# Altium schematic sheet USB_PLEIADES.SchDoc
size Tabloid; Sheet_Name: Insert name in Document Parameters; Size: 11x17
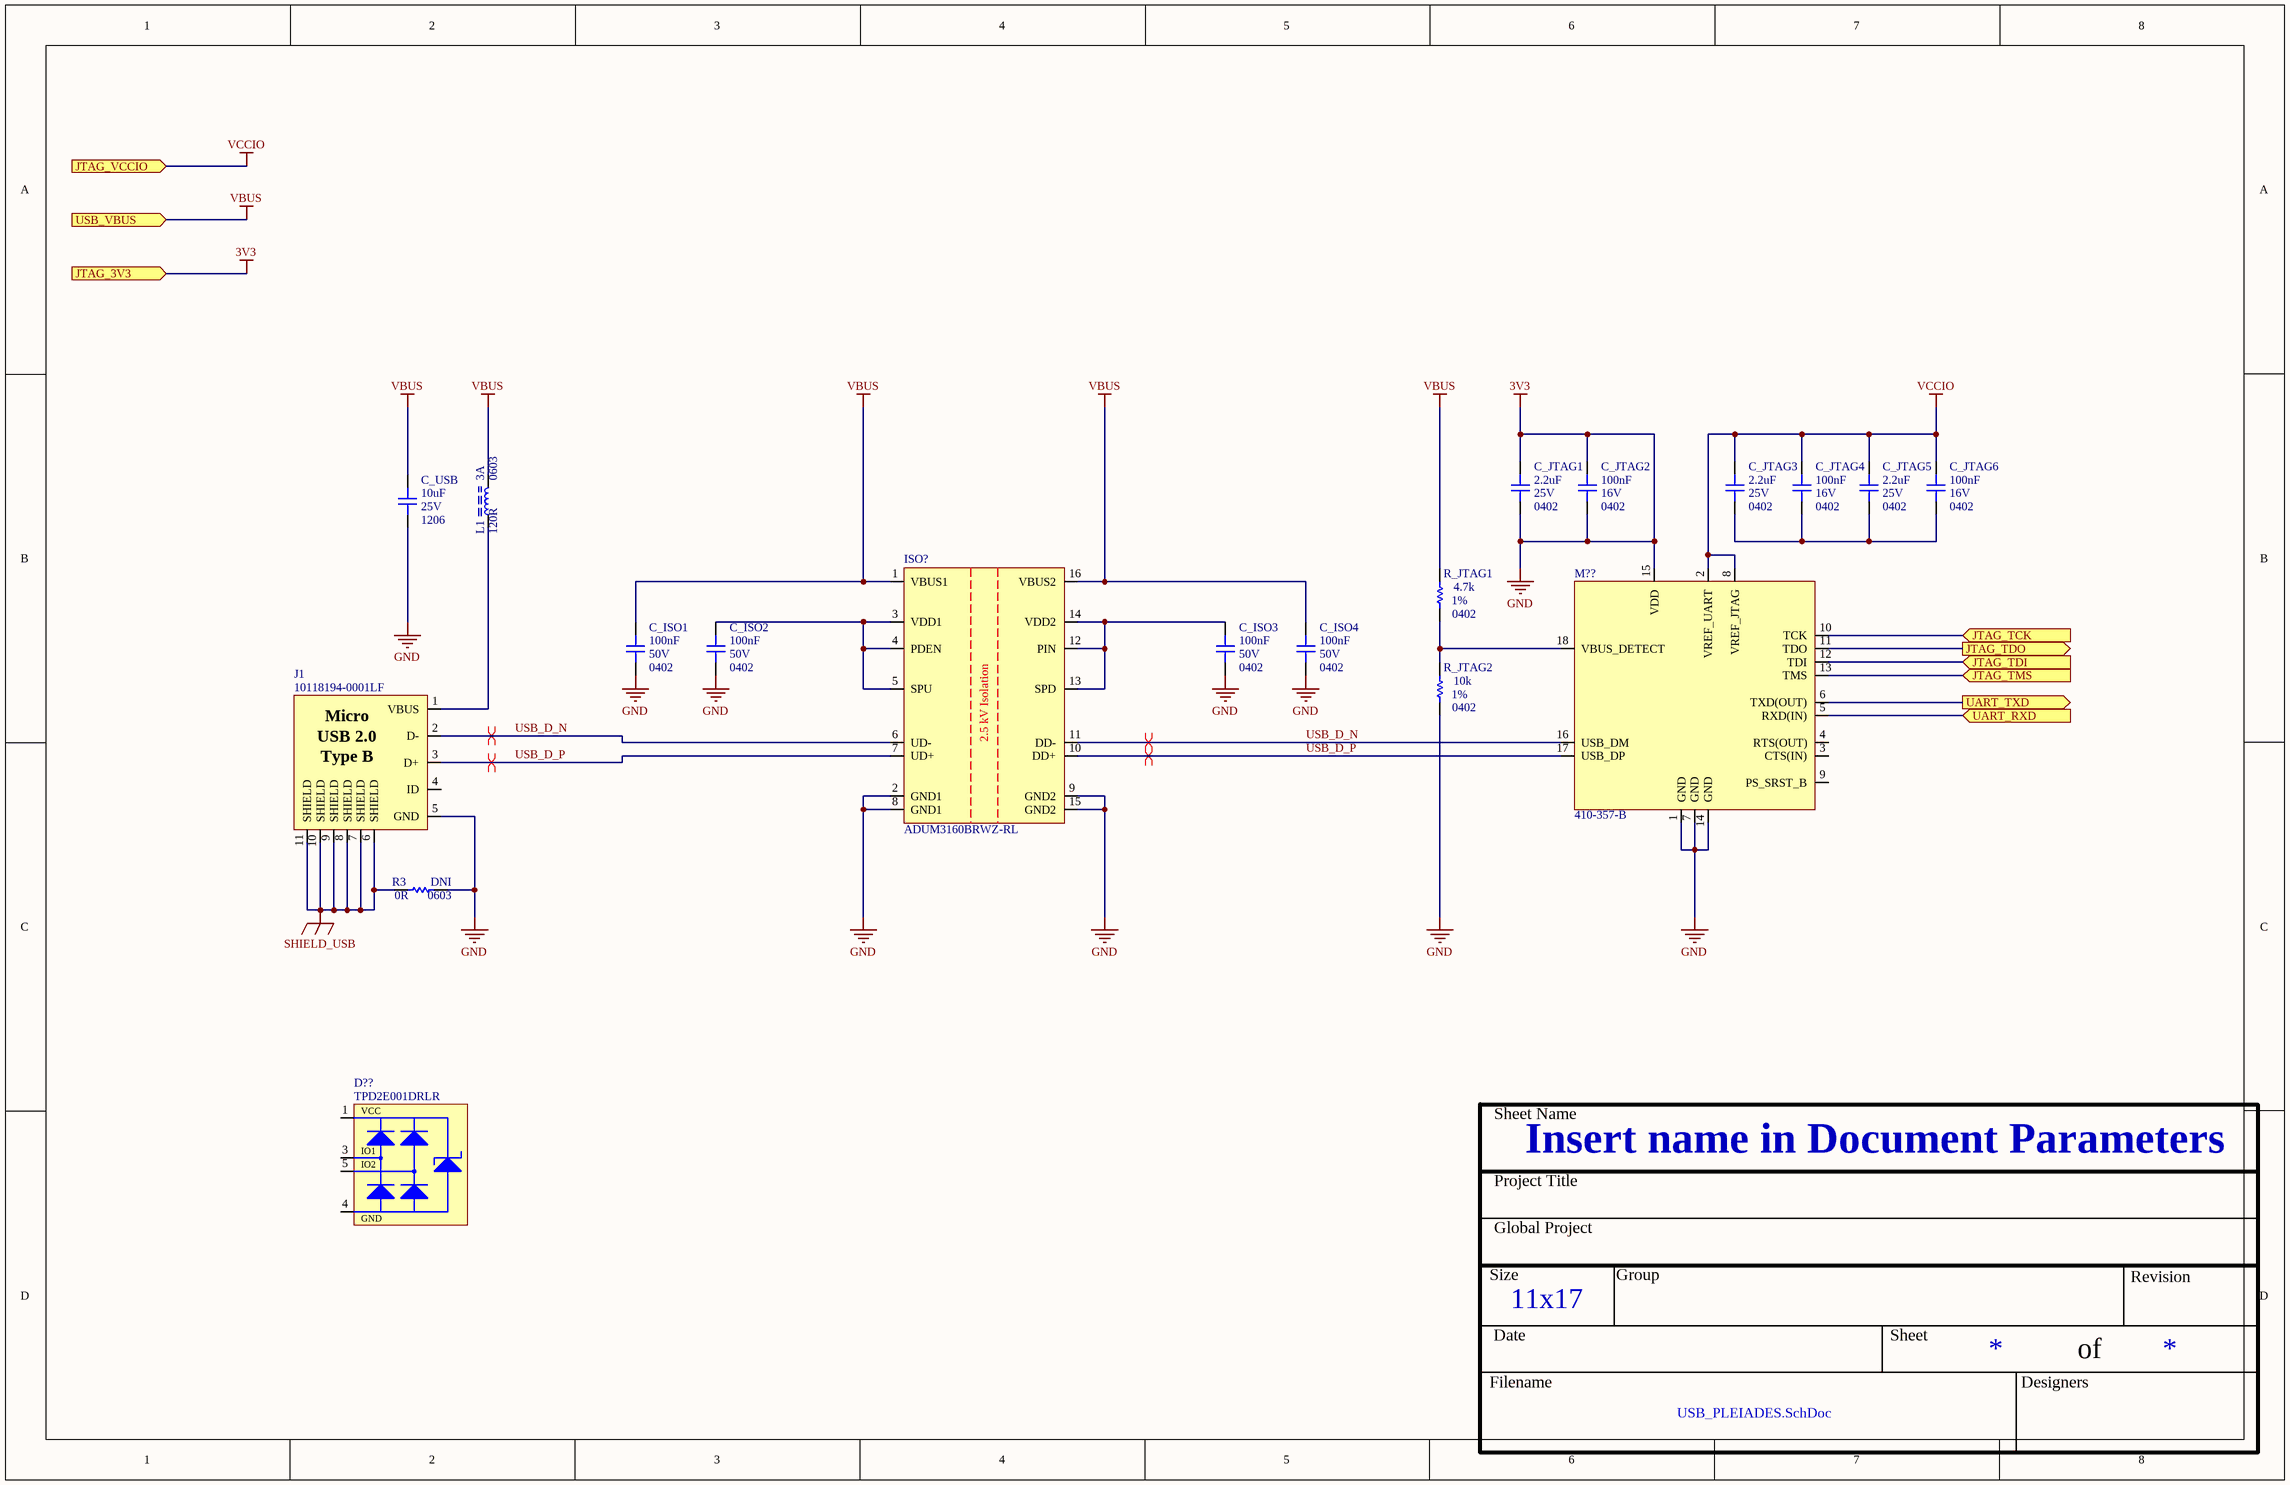
[diagram p0: USB_PLEIADES.SchDoc]

## Parts
C_ISO1  value 100nF  Voltage: 50V  Package: 0402  [CAP_0402]  (hidden comment: CAP - 0402)
C_ISO2  value 100nF  Voltage: 50V  Package: 0402  [CAP_0402]  (hidden comment: CAP - 0402)
C_ISO3  value 100nF  Voltage: 50V  Package: 0402  [CAP_0402]  (hidden comment: CAP - 0402)
C_ISO4  value 100nF  Voltage: 50V  Package: 0402  [CAP_0402]  (hidden comment: CAP - 0402)
C_JTAG1  value 2.2uF  Voltage: 25V  Package: 0402  [CAP_0402]  (hidden comment: CAP - 0402)
C_JTAG2  value 100nF  Voltage: 16V  Package: 0402  [CAP_0402]  (hidden comment: CAP - 0402)
C_JTAG3  value 2.2uF  Voltage: 25V  Package: 0402  [CAP_0402]  (hidden comment: CAP - 0402)
C_JTAG4  value 100nF  Voltage: 16V  Package: 0402  [CAP_0402]  (hidden comment: CAP - 0402)
C_JTAG5  value 2.2uF  Voltage: 25V  Package: 0402  [CAP_0402]  (hidden comment: CAP - 0402)
C_JTAG6  value 100nF  Voltage: 16V  Package: 0402  [CAP_0402]  (hidden comment: CAP - 0402)
C_USB  value 10uF  Voltage: 25V  Package: 1206  [CAP_1206]  (hidden comment: CAP - 1206)
D??  TPD2E001DRLR  [TVS_USB_TPD2E001DRLR]
ISO?  ADUM3160BRWZ-RL  [ISO_ADUM3160BRWZ-RL]
J1  10118194-0001LF  [CON_USB_10118194-0001LF]
L1  value 120R  Current: 3A  Package: 0603  [FER_0603]  (hidden comment: FER - 0603)
M??  410-357-B  [MOD_JTAG_410-357-B]
R3  value 0R  Package: 0603  Precision: DNI  [RES_0603]  (hidden comment: RES - 0603)
R_JTAG1  value 4.7k  Package: 0402  Precision: 1%  [RES_0402]  (hidden comment: RES - 0402)
R_JTAG2  value 10k  Package: 0402  Precision: 1%  [RES_0402]  (hidden comment: RES - 0402)

## Ports
JTAG_3V3 (in), JTAG_TCK (in), JTAG_TDI (in), JTAG_TDO (out), JTAG_TMS (in), JTAG_VCCIO (in), UART_RXD (in), UART_TXD (out), USB_VBUS (in)

## Nets
3V3: C_ISO1.1 C_ISO2.1 C_ISO3.1 C_ISO4.1 C_JTAG1.1 C_JTAG1.2 C_JTAG2.1 C_JTAG2.2 C_USB.1 ISO?.2(GND1) ISO?.8(GND1) ISO?.9(GND2) ISO?.15(GND2) J1.5(GND) M??.1(GND) M??.7(GND) M??.14(GND) M??.15(VDD) R3.1 R_JTAG2.1 ; port JTAG_3V3  [also labelled GND]
SHIELD_USB: J1.6(SHIELD) J1.7(SHIELD) J1.8(SHIELD) J1.9(SHIELD) J1.10(SHIELD) J1.11(SHIELD) R3.2
VBUS: C_ISO1.2 C_ISO4.2 C_USB.2 ISO?.1(VBUS1) ISO?.16(VBUS2) L1.1 R_JTAG1.2 ; port USB_VBUS
VCCIO: C_JTAG3.2 C_JTAG4.2 C_JTAG5.2 C_JTAG6.2 M??.2(VREF_UART) M??.8(VREF_JTAG) ; port JTAG_VCCIO
JTAG_TCK: M??.10(TCK) ; port JTAG_TCK
JTAG_TDI: M??.12(TDI) ; port JTAG_TDI
JTAG_TDO: M??.11(TDO) ; port JTAG_TDO
JTAG_TMS: M??.13(TMS) ; port JTAG_TMS
UART_RXD: M??.5(RXD(IN)) ; port UART_RXD
UART_TXD: M??.6(TXD(OUT)) ; port UART_TXD
USB_D_N: ISO?.6(UD-) ISO?.11(DD-) J1.2(D-) M??.16(USB_DM)
USB_D_P: ISO?.7(UD+) ISO?.10(DD+) J1.3(D+) M??.17(USB_DP)
NetC_ISO2_2: C_ISO2.2 ISO?.3(VDD1) ISO?.4(PDEN) ISO?.5(SPU)
NetC_ISO3_2: C_ISO3.2 ISO?.12(PIN) ISO?.13(SPD) ISO?.14(VDD2)
NetC_JTAG3_1: C_JTAG3.1 C_JTAG4.1 C_JTAG5.1 C_JTAG6.1
NetJ1_1: J1.1(VBUS) L1.2
NetM??_18: M??.18(VBUS_DETECT) R_JTAG1.1 R_JTAG2.2

Not connected (* = marked no-connect by the designer): D?? 1(VCC) 2(NC) 3(IO1) 4(GND) 5(IO2); J1 4(ID); M?? 3(CTS(IN)) 4(RTS(OUT)) 9(PS_SRST_B)

## Layout directives
differential pair: USB_D_N, USB_D_P

## Notes on the sheet
- Sheet Name
- Project Title
- Global Project
- Size
- Group
- Revision
- Date
- Sheet
- of
- Filename
- Designers
- (in symbol CON_USB_10118194-0001LF) Micro; USB 2.0; Type B
- (in symbol ISO_ADUM3160BRWZ-RL) 2.5 kV Isolation

## Library data of the parts
C_ISO1-C_ISO4 C_JTAG1-C_JTAG6 = CAP - 0402: Precision: 10%; Current: *; CreatedBy: Jonathan Bouchard; Power: *
C_USB = CAP - 1206: Precision: 10%; Current: *; CreatedBy: Jonathan Bouchard; Power: *
D?? = TVS_USB_TPD2E001DRLR: TVS - USB TVS DIODE 5.5V - SOT-553; Manufacturer #1: Texas Instruments; Value: 11V Breakdown; Voltage Rating: 5.5V (Max); GRAMS Lib Spec: 2.8; Magnetic Material: YES; Cryo: UNKNOWN; Tolerance: *; Current Rating: *; Power Max: *; HelpURL: http://www.ti.com/lit/ds/symlink/tpd2e001.pdf; CreatedBy/Date: Jonathan Bouchard 2018-07-10; VerifiedBy: Arnaud Samson 16-07-18; Temperature: -40°C ~ 85°C (TA); Package: SOT-553; Manufacturer #2: *; Note: *; Assembly Type: SMD; Part Number #2: *; Part Number #1: TPD2E001DRLR; Polarized: YES; Supplier 1: Digi-Key; Supplier Part Number 1: 296-21883-1-ND
ISO? = ISO_ADUM3160BRWZ-RL: ISO - DGTL ISO 2.5KV 2CH USB - 16SOIC; Manufacturer #1: Analog Devices; Value: 2500Vrms voltage isolation; Voltage Rating: 3~5.5V; GRAMS Lib Spec: 2.8; Magnetic Material: UNKNOWN; Polarized: Yes; Tolerance: *; Current Rating: *; Power Max: *; HelpURL: https://www.analog.com/media/en/technical-documentation/data-sheets/ADuM3160.pdf; CreatedBy/Date: Tommy Rossignol 2018-11-16; VerifiedBy: Caroline Paulin - 13 février 2019; Temperature: -40°C ~ 105°C; Package: 16-SOIC; Manufacturer #2: *; Assembly Type: SMD; Part Number #2: *; Part Number #1: ADUM3160BRWZ-RL; Supplier 1: Digi-Key; Supplier Part Number 1: ADUM3160BRWZ-RLCT-ND; Cryo: UNKNOWN
J1 = CON_USB_10118194-0001LF: CON - USB MICRO B RECPT SMT R/A - 4PIN; Manufacturer #1: Amphenol FCI; Value: USB - Micro B; Voltage Rating: 100VAC; Current Rating: 1.8A; GRAMS Lib Spec: 2.8; Magnetic Material: YES; Cryo: UNKNOWN; Tolerance: *; Power Max: *; HelpURL: https://cdn.amphenol-icc.com/media/wysiwyg/files/drawing/10118194.pdf; CreatedBy/Date: Arnaud Samson - 09/07/18; VerifiedBy: Jonathan Bouchard 2018-07-12; Temperature: -30°C ~ 80°C; Package: 5-SMD; Manufacturer #2: *; Note: *; Assembly Type: SMD; Part Number #2: *; Part Number #1: 10118194-0001LF; Polarized: YES; Supplier 1: Digi-Key; Supplier Part Number 1: 609-4618-1-ND
M?? = MOD_JTAG_410-357-B: MOD - JTAG-SMT3-NC Programming Module For Xilinx FPGA - 18-SMT; Manufacturer #1: Digilent; Voltage Rating: VDD: 2.97V~3.63V, VJTAG/VUART: 1.65V~5.5V; GRAMS Lib Spec: 2.8; Note: Prior to reflow, the JTAG-SMT3-NC module must be dried at 125°C for 17 hours; Magnetic Material: Unknown; Polarized: Yes; Value: *; Tolerance: *; Current Rating: *; Power Max: *; HelpURL: https://reference.digilentinc.com/_media/reference/programmers/jtag-smt3/jtag-smt3-nc_rm.pdf; CreatedBy/Date: Tommy Rossignol 2018-11-23; VerifiedBy: Nicolas V. (2019-01-28); Temperature: -40°C ~ 85°C; Package: 18-pad SMT; Manufacturer #2: *; Assembly Type: SMD; Part Number #2: *; Part Number #1: 410-357-B; Supplier 1: Digi-Key; Supplier Part Number 1: 1286-1196-ND; Cryo: UNKNOWN
R_JTAG1 R_JTAG2 = RES - 0402: Voltage: 50V; Power: 1/16W; Current: *; CreatedBy: Jonathan Bouchard
L1 = FER - 0603: Voltage: *; CreatedBy: Jonathan Bouchard; Power: *; Precision: *
R3 = RES - 0603: Current: *; CreatedBy: Jonathan Bouchard